# Altium project DLDT_Project.PrjPcb
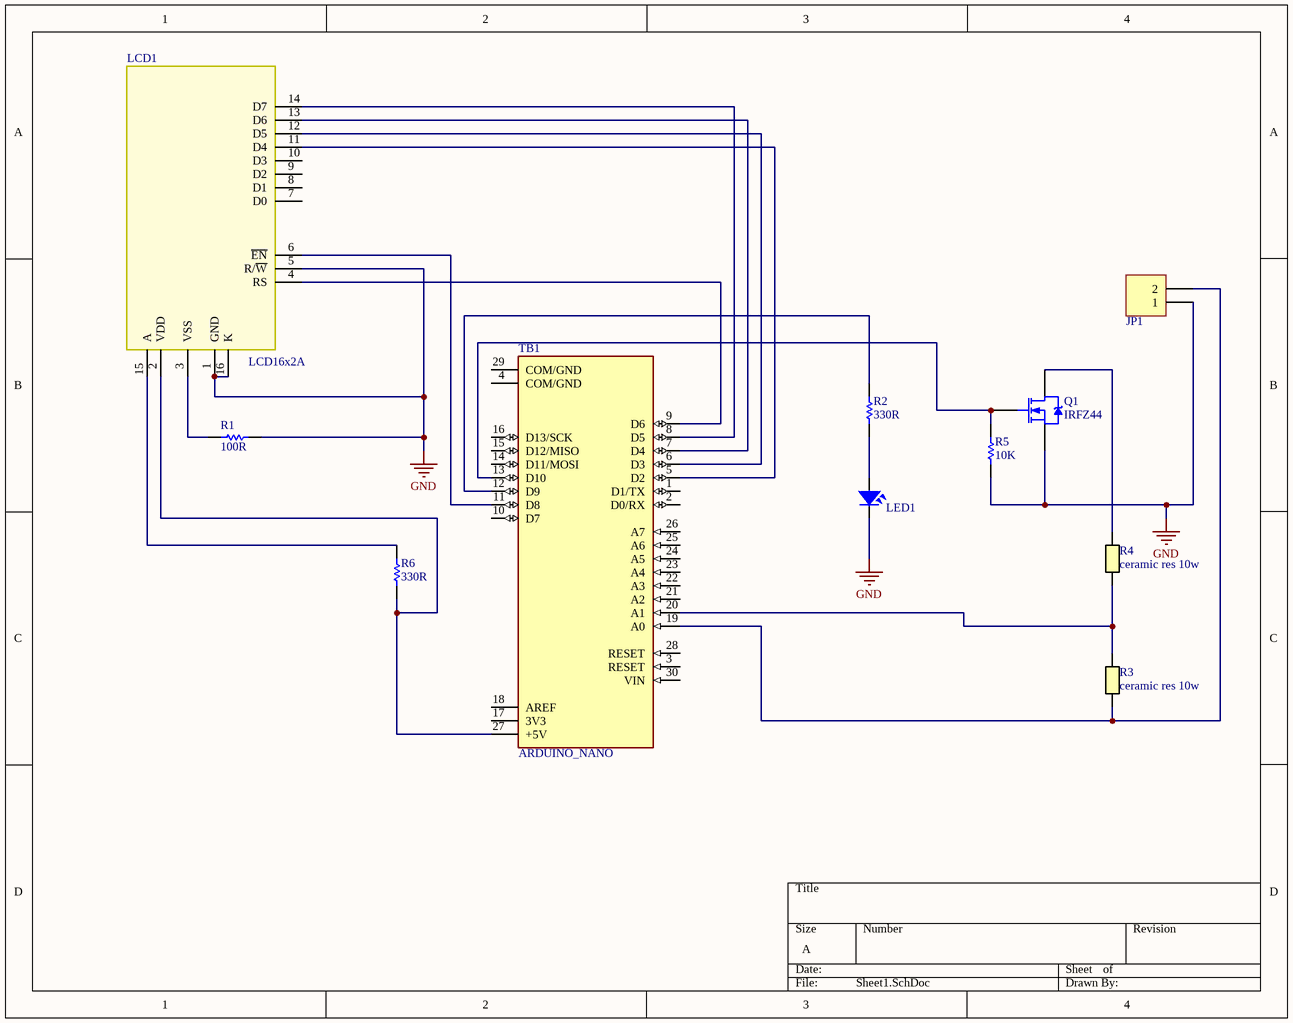
[diagram p0: Sheet1.SchDoc]
1 sheet, 11 parts. Net scope: global (net labels, ports and power ports of the same name join across sheets).
Board file: PCB1.PcbDoc

## Sheet Sheet1.SchDoc
size A

### Parts
JP1  Header 2_1  [HED2]  (value not drawn)
LCD1  LCD16x2A  [LCD16X2]
LED1  LED  [LED-3]  (value not drawn)
Q1  IRFZ44  [QTO-220H3]
R1  value 100R  [R1/4W]  (hidden comment: Res1)
R2  value 330R  [R1/4W]  (hidden comment: Res1)
R3  ceramic res 10w  [ceramic res 10w]
R4  ceramic res 10w  [ceramic res 10w]
R5  value 10K  [R1/4W]  (hidden comment: Res1)
R6  value 330R  [R1/4W]  (hidden comment: Res1)
TB1  ARDUINO_NANO  [SHIELD_ARDUINO_NANO]

### Nets
GND: JP1.1 LCD1.1(GND) LCD1.5(R/~{W}) LCD1.16(K) LED1.2 Q1.3(S) R1.1 R5.1
NetJP1_2: JP1.2 R3.1 TB1.19(A0)
NetLCD1_2: LCD1.2(VDD) R6.1 TB1.27(+5V)
NetLCD1_3: LCD1.3(VSS) R1.2
NetLCD1_4: LCD1.4(RS) TB1.9(D6)
NetLCD1_6: LCD1.6(~{EN}) TB1.11(D8)
NetLCD1_11: LCD1.11(D4) TB1.5(D2)
NetLCD1_12: LCD1.12(D5) TB1.6(D3)
NetLCD1_13: LCD1.13(D6) TB1.7(D4)
NetLCD1_14: LCD1.14(D7) TB1.8(D5)
NetLCD1_15: LCD1.15(A) R6.2
NetLED1_1: LED1.1 R2.1
NetQ1_1: Q1.1(G) R5.2 TB1.13(D10)
NetQ1_2: Q1.2(D) R4.2
NetR2_2: R2.2 TB1.12(D9)
NetR3_2: R3.2 R4.1 TB1.20(A1)

Not connected (* = marked no-connect by the designer): LCD1 7(D0) 8(D1) 9(D2) 10(D3); TB1 1(D1/TX) 2(D0/RX) 3(RESET) 4(COM/GND) 10(D7) 14(D11/MOSI) 15(D12/MISO) 16(D13/SCK) 17(3V3) 18(AREF) 21(A2) 22(A3) 23(A4) 24(A5) 25(A6) 26(A7) 28(RESET) 29(COM/GND) 30(VIN)

### Library data of the parts
JP1 = Header 2_1: Header, 2-Pin; Manufacturer: Generic Components; Class: Connector; Value: Header 2
LCD1 = LCD16x2: LCD dipslay 16 char, 2 line; Value: LCD16x2A
LED1 = LED: LED Single colour Green and Red; Value: LED 3 ly Single Colour
Q1 = IRFZ44: HEXFET N-Channel Power MOSFET
R1 R2 R5 R6 = Res1_1: Resistor; Manufacturer: Generic Components; Class: Passive; Published: 08/06/2000; Publisher: Altium Hobart Technology Centre; SubClass: Resistor
TB1 = ARDUINO_NANO: Small, complete, and breadboard-friendly board based on the ATmega328 (Arduino Nano 3.x); Check_prices: https://www.snapeda.com/parts/Arduino%20Nano/Arduino/view-part/?ref=eda; Value: *; Availability: Not in stock; MP: Arduino Nano; Price: None; Package: Non-Standard Arduino; SnapEDA_Link: https://www.snapeda.com/parts/Arduino%20Nano/Arduino/view-part/?ref=snap; MF: Arduino